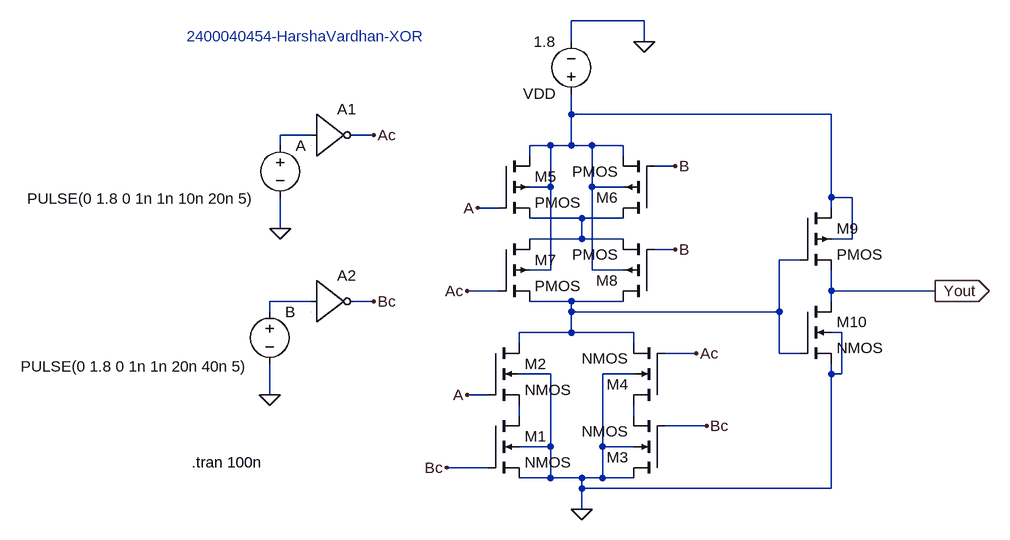
[diagram p0: schematic Xor-Gate.asc]
Xor-Gate.asc, the LTspice schematic file:
Version 4.1
SHEET 1 944 680
WIRE 384 -464 272 -464
WIRE 272 -432 272 -464
WIRE 384 -432 384 -464
WIRE 272 -320 272 -352
WIRE 672 -320 272 -320
WIRE -128 -288 -176 -288
WIRE -32 -288 -64 -288
WIRE -176 -272 -176 -288
WIRE 240 -272 208 -272
WIRE 272 -272 272 -320
WIRE 272 -272 240 -272
WIRE 304 -272 272 -272
WIRE 352 -272 304 -272
WIRE 208 -256 208 -272
WIRE 352 -256 352 -272
WIRE 432 -240 400 -240
WIRE 240 -208 240 -272
WIRE 240 -208 208 -208
WIRE 304 -208 304 -272
WIRE 352 -208 304 -208
WIRE 672 -192 672 -320
WIRE 704 -192 672 -192
WIRE 160 -176 128 -176
WIRE 672 -176 672 -192
WIRE 288 -160 208 -160
WIRE 352 -160 288 -160
WIRE -176 -144 -176 -192
WIRE 288 -128 288 -160
WIRE 288 -128 208 -128
WIRE 352 -128 288 -128
WIRE 704 -128 704 -192
WIRE 704 -128 672 -128
WIRE 432 -112 400 -112
WIRE 624 -96 592 -96
WIRE 240 -80 240 -208
WIRE 240 -80 208 -80
WIRE 304 -80 304 -208
WIRE 352 -80 304 -80
WIRE 160 -48 112 -48
WIRE 672 -48 672 -80
WIRE 832 -48 672 -48
WIRE -128 -32 -192 -32
WIRE -32 -32 -64 -32
WIRE 272 -32 208 -32
WIRE 352 -32 272 -32
WIRE 672 -32 672 -48
WIRE -192 -16 -192 -32
WIRE 272 -16 272 -32
WIRE 592 -16 592 -96
WIRE 592 -16 272 -16
WIRE 272 16 272 -16
WIRE 272 16 192 16
WIRE 368 16 272 16
WIRE 688 16 672 16
WIRE 192 32 192 16
WIRE 368 32 368 16
WIRE 464 48 416 48
WIRE 592 48 592 -16
WIRE 624 48 592 48
WIRE 240 80 192 80
WIRE 368 80 320 80
WIRE 672 80 672 64
WIRE 688 80 688 16
WIRE 688 80 672 80
WIRE -192 112 -192 64
WIRE 144 112 112 112
WIRE 192 144 192 128
WIRE 368 144 368 128
WIRE 480 160 416 160
WIRE 240 192 240 80
WIRE 240 192 192 192
WIRE 320 192 320 80
WIRE 368 192 320 192
WIRE 144 224 80 224
WIRE 240 240 240 192
WIRE 240 240 192 240
WIRE 288 240 240 240
WIRE 320 240 320 192
WIRE 320 240 288 240
WIRE 368 240 320 240
WIRE 288 256 288 240
WIRE 672 256 672 80
WIRE 672 256 288 256
WIRE 288 288 288 256
FLAG 288 288 0
FLAG 384 -432 0
FLAG 832 -48 Yout
IOPIN 832 -48 Out
FLAG -176 -144 0
FLAG -192 112 0
FLAG 128 -176 A
FLAG 112 112 A
FLAG 112 -48 Ac
FLAG 464 48 Ac
FLAG 432 -240 B
FLAG 432 -112 B
FLAG 480 160 Bc
FLAG 80 224 Bc
FLAG -32 -288 Ac
FLAG -32 -32 Bc
SYMBOL nmos4 144 144 R0
SYMATTR InstName M1
SYMBOL nmos4 144 32 R0
SYMATTR InstName M2
SYMBOL nmos4 416 240 R180
SYMATTR InstName M3
SYMBOL nmos4 416 128 R180
SYMATTR InstName M4
SYMBOL pmos4 160 -256 R0
SYMATTR InstName M5
SYMBOL pmos4 400 -160 R180
SYMATTR InstName M6
SYMBOL pmos4 160 -128 R0
SYMATTR InstName M7
SYMBOL pmos4 400 -32 R180
SYMATTR InstName M8
SYMBOL voltage -176 -288 R0
WINDOW 3 -389 98 Left 2
WINDOW 123 0 0 Left 0
WINDOW 39 0 0 Left 0
SYMATTR Value PULSE(0 1.8 0 1n 1n 10n 20n 5)
SYMATTR InstName A
SYMBOL voltage -192 -32 R0
WINDOW 3 -383 100 Left 2
WINDOW 123 0 0 Left 0
WINDOW 39 0 0 Left 0
SYMATTR Value PULSE(0 1.8 0 1n 1n 20n 40n 5)
SYMATTR InstName B
SYMBOL voltage 272 -336 R180
WINDOW 123 0 0 Left 0
WINDOW 39 0 0 Left 0
SYMATTR InstName VDD
SYMATTR Value 1.8
SYMBOL pmos4 624 -176 R0
SYMATTR InstName M9
SYMBOL nmos4 624 -32 R0
SYMATTR InstName M10
SYMBOL Digital\\inv -128 -352 R0
SYMATTR InstName A1
SYMBOL Digital\\inv -128 -96 R0
SYMATTR InstName A2
TEXT -312 216 Left 2 !.tran 100n
TEXT -320 -440 Left 2 ;2400040454-HarshaVardhan-XOR

The netlist it stands for:
* Xor-Gate.asc
M1 N006 Bc 0 0 NMOS
M2 N004 A N006 0 NMOS
M3 0 Bc N007 0 NMOS
M4 N007 Ac N004 0 NMOS
M5 N001 A N003 N001 PMOS
M6 N003 B N001 N001 PMOS
M7 N003 Ac N004 N001 PMOS
M8 N004 B N003 N001 PMOS
V§A N002 0 PULSE(0 1.8 0 1n 1n 10n 20n 5)
V§B N005 0 PULSE(0 1.8 0 1n 1n 20n 40n 5)
VDD N001 0 1.8
M9 N001 N004 Yout N001 PMOS
M10 Yout N004 0 0 NMOS
A1 N002 0 0 0 0 Ac 0 0 BUF
A2 N005 0 0 0 0 Bc 0 0 BUF
.model NMOS NMOS
.model PMOS PMOS
.lib standard.mos
.tran 100n
* 2400040454-HarshaVardhan-XOR
.backanno
.end